# EAGLE schematic MSSRP-TC_IF (EAGLE 6.6.0)
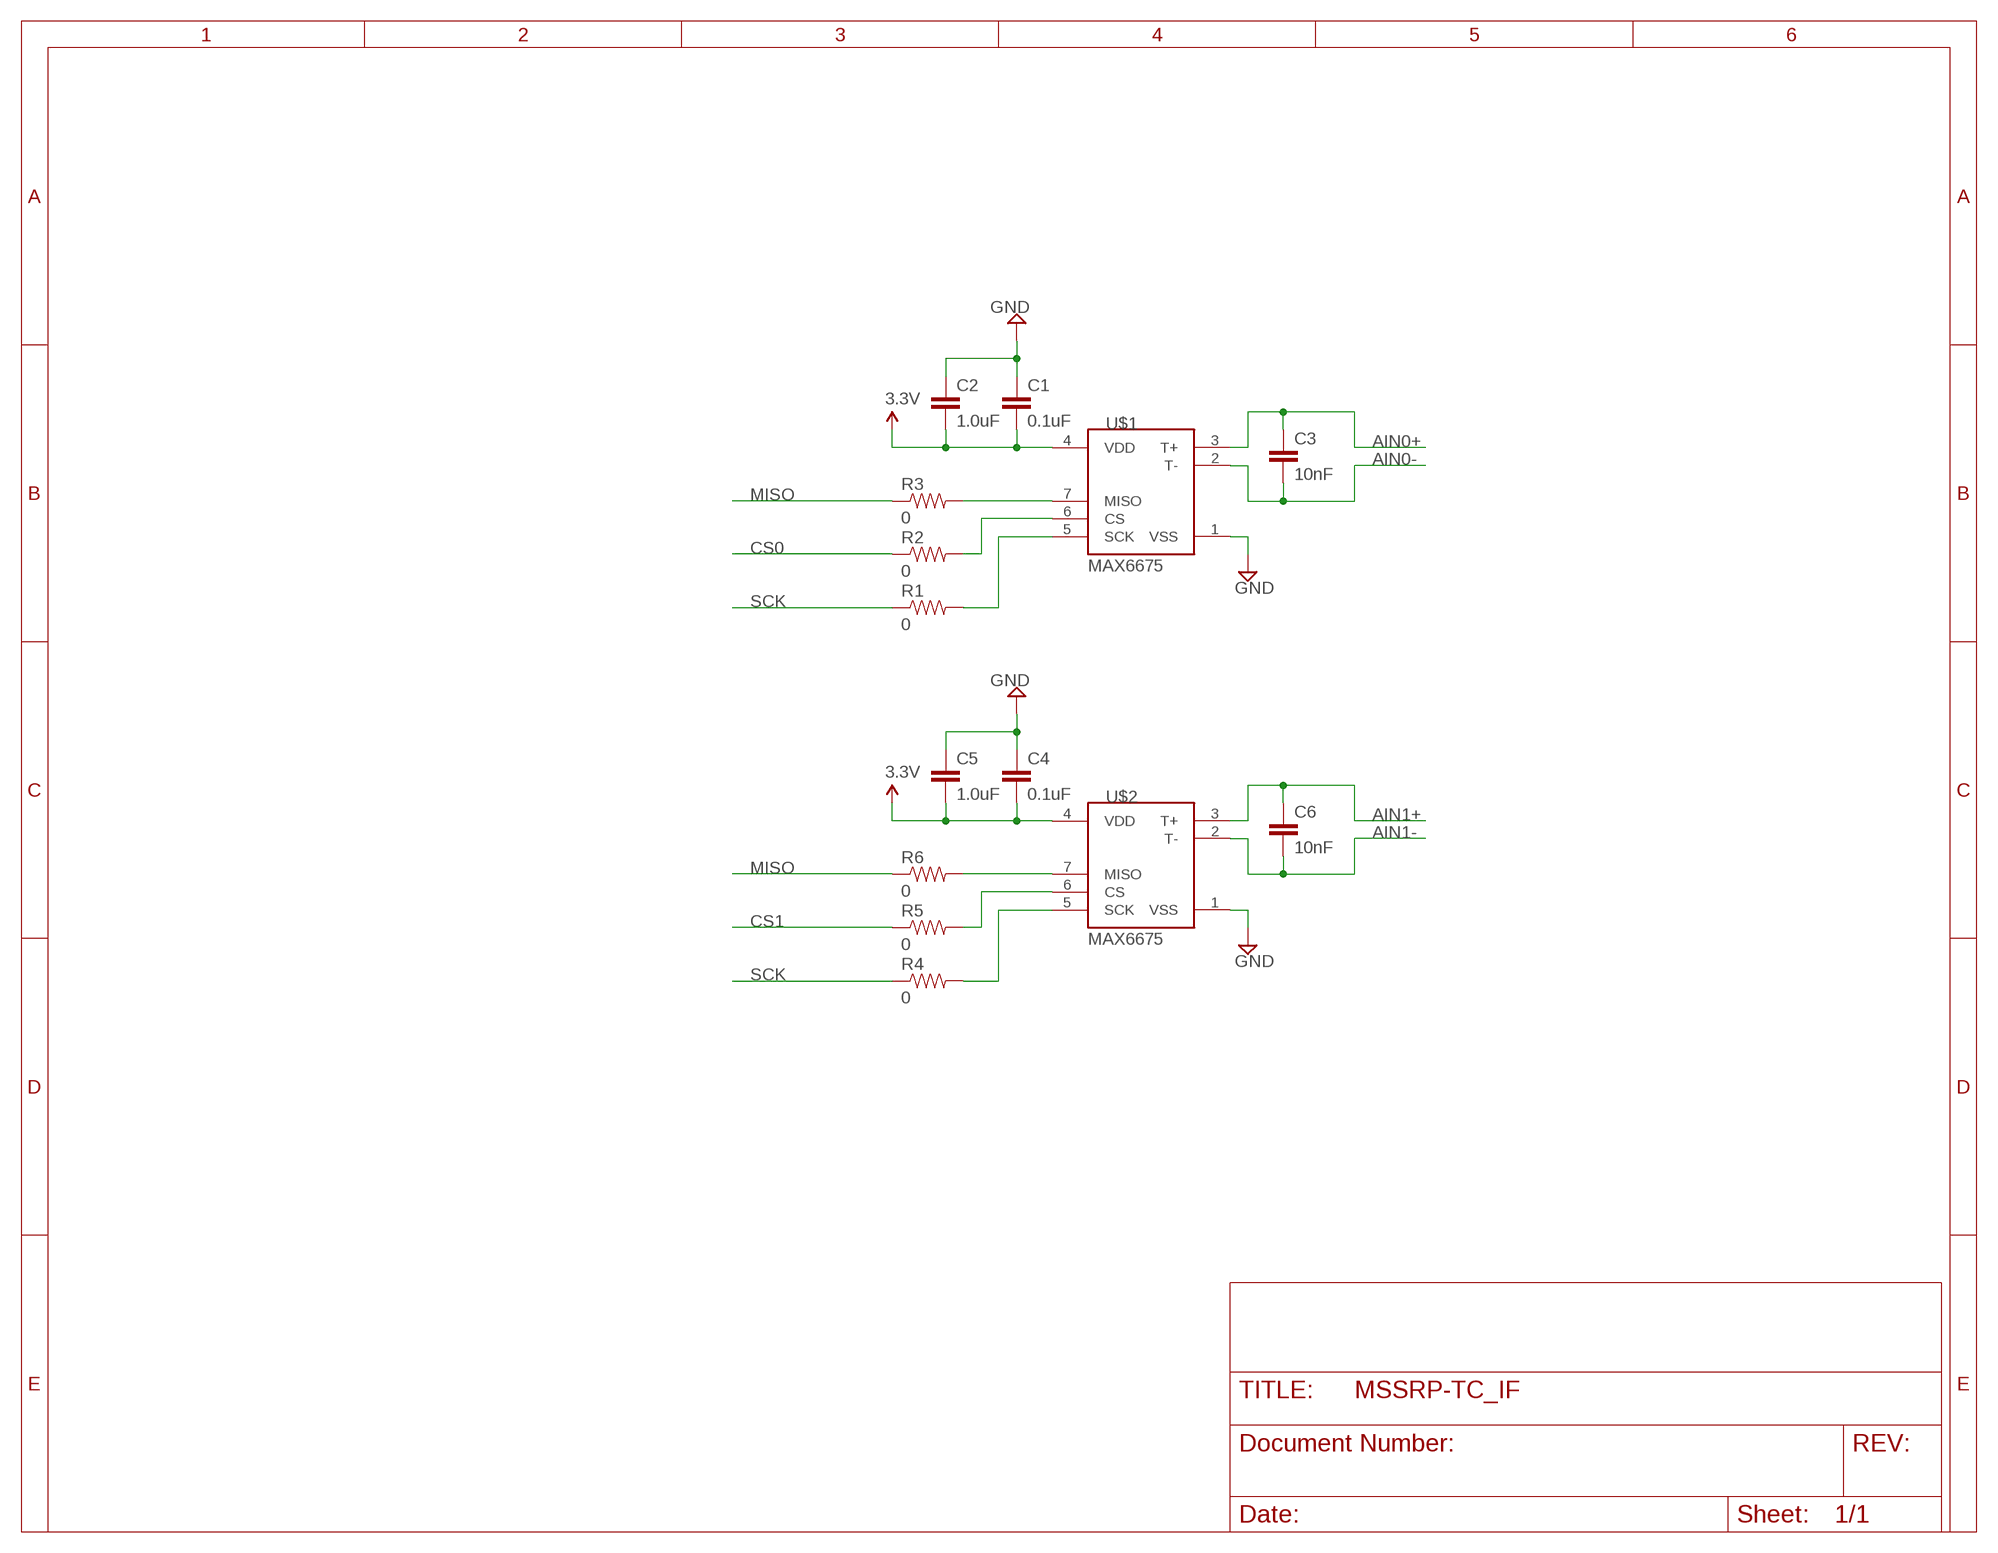
[diagram p0: schematic, sheet 1]

## Parts
C1  0.1uF  0.1UF-25V-5%(0603)  [0603-CAP]
C2  1.0uF  1.0UF-16V-10%(0603)  [0603-CAP]
C3  10nF  10NF/10000PF-50V-10%(0603)  [0603-CAP]
C4  0.1uF  0.1UF-25V-5%(0603)  [0603-CAP]
C5  1.0uF  1.0UF-16V-10%(0603)  [0603-CAP]
C6  10nF  10NF/10000PF-50V-10%(0603)  [0603-CAP]
R1  0  0OHM1/10W5%(0603)  [0603]
R2  0  0OHM1/10W5%(0603)  [0603]
R3  0  0OHM1/10W5%(0603)  [0603]
R4  0  0OHM1/10W5%(0603)  [0603]
R5  0  0OHM1/10W5%(0603)  [0603]
R6  0  0OHM1/10W5%(0603)  [0603]
U$1  MAX6675  [SO08-MAX6675]
U$2  MAX6675  [SO08-MAX6675]

## Nets
3.3V: C1.2 C2.2 C4.2 C5.2 U$1.4(VDD) U$2.4(VDD)
AIN0+: C3.1 U$1.3(T+)
AIN0-: C3.2 U$1.2(T-)
AIN1+: C6.1 U$2.3(T+)
AIN1-: C6.2 U$2.2(T-)
CS0: R2.1
CS1: R5.1
GND: C1.1 C2.1 C4.1 C5.1 U$1.1(VSS) U$2.1(VSS)
MISO: R3.1 R6.1
N$1: R3.2 U$1.7(MISO)
N$2: R2.2 U$1.6(CS)
N$3: R1.2 U$1.5(SCK)
N$9: R6.2 U$2.7(MISO)
N$10: R5.2 U$2.6(CS)
N$11: R4.2 U$2.5(SCK)
SCK: R1.1 R4.1

## Library data of the parts
C1 C4 = SparkFun-Capacitors:0.1UF-25V-5%(0603): CAP-08604; PROD_ID: CAP-08604
C2 C5 = SparkFun-Capacitors:1.0UF-16V-10%(0603): CAP-00868; PROD_ID: CAP-00868
C3 C6 = SparkFun-Capacitors:10NF/10000PF-50V-10%(0603): CAP-00867; PROD_ID: CAP-00867
R1-R6 = SparkFun-Resistors:0OHM1/10W5%(0603): RES-08609; PROD_ID: RES-08609
U$1 U$2 = SparkFun-AnalogIC:MAX6675: K-type thermocouple ADC, SPI output